# EAGLE schematic Outlet2 (EAGLE 7.5.0)
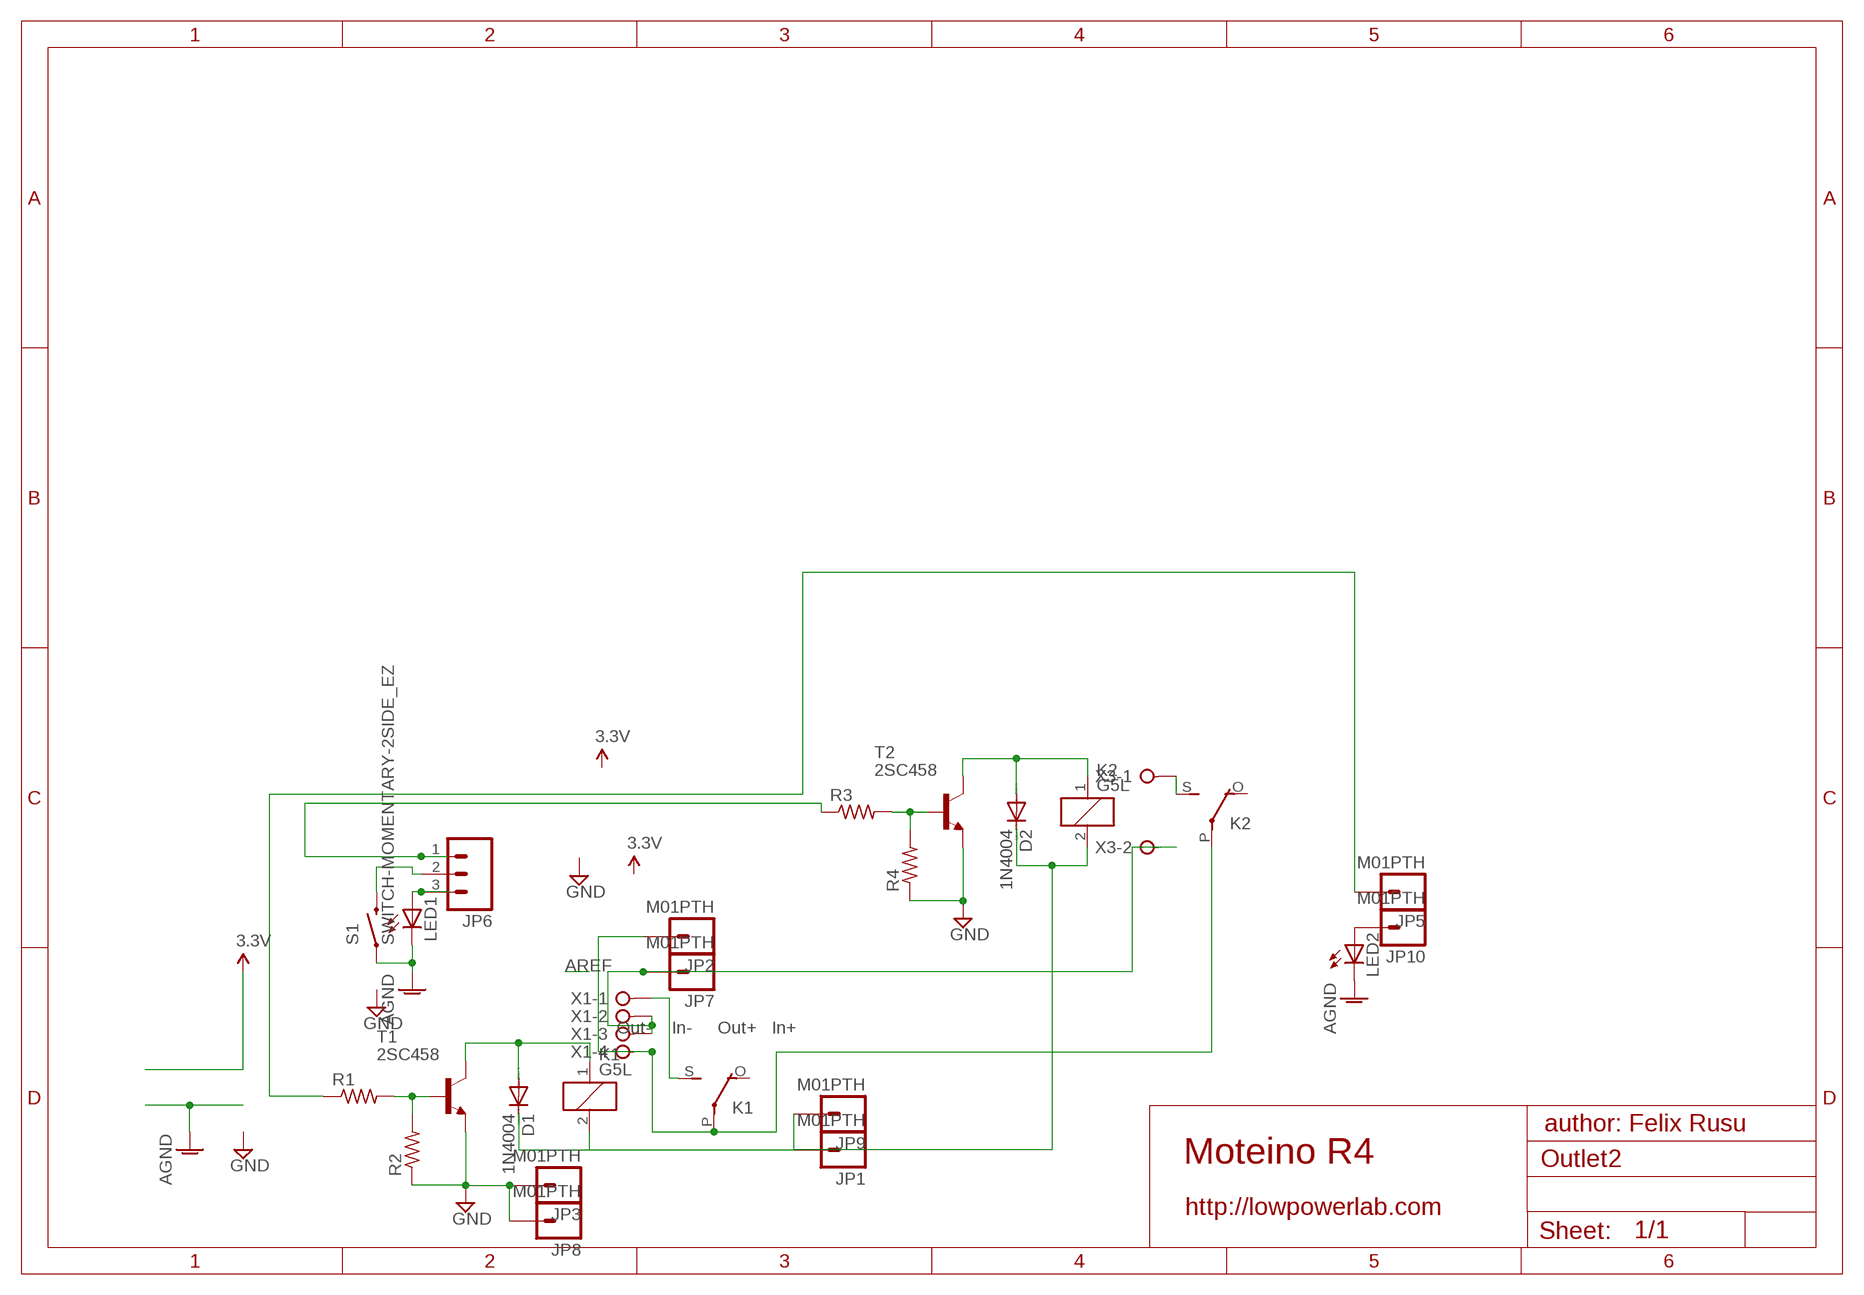
[diagram p0: schematic, sheet 1]

## Parts
D1  1N4004  [DO41-10]
D2  1N4004  [DO41-10]
JP1  M01PTH  [1X01]
JP2  M01PTH  [1X01]
JP3  M01PTH  [1X01]
JP5  M01PTH  [1X01]
JP6  M03PTH  [1X03]
JP7  M01PTH  [1X01]
JP8  M01PTH  [1X01]
JP9  M01PTH  [1X01]
JP10  M01PTH  [1X01]
K1  G5L  [G5LE]
K2  G5L  [G5LE]
LED1  LED3MM  [LED3MM]
LED2  LED3MM  [LED3MM]
R1  R-US_0204/7  [0204/7]
R2  R-US_0204/7  [0204/7]
R3  R-US_0204/7  [0204/7]
R4  R-US_0204/7  [0204/7]
S1  SWITCH-MOMENTARY-2SIDE_EZ  [TACTILE-PTH-SIDEEZ]
T1  2SC458  [TO92-ECB]
T2  2SC458  [TO92-ECB]
X1  Out- In- Out+ In+  W237-04P  [W237-4P]
X3  W237-02P  [W237-132]

## Nets
AGND [power]: LED1.K(C) LED2.K(C) S1.1
GND [power]: JP3.1 JP8.1 R2.1 R4.1 T1.E T2.E
N$1: JP6.2 S1.2
N$2: K2.S(2:S) X3.1
N$3: JP6.3 LED1.A
N$4: R1.2 R2.2 T1.B
N$5: JP10.1 LED2.A
N$6: D1.A K1.1 T1.C
N$7: JP5.1 R1.1
N$8: K1.S(2:S) X1.1
N$9: JP2.1 K1.P(2:P) K2.P(2:P) X1.4
N$10: JP6.1 R3.1
N$11: R3.2 R4.2 T2.B
N$12: D2.A K2.1 T2.C
N$13: D1.C D2.C JP1.1 JP9.1 K1.2 K2.2
N$15: JP7.1 X1.2 X1.3 X3.2
Unconnected: K1.O(2:O) K2.O(2:O)

## Notes on the sheet
- author: Felix Rusu
- Moteino R4
- http://lowpowerlab.com

## Library data of the parts
D1 D2 = diode:1N4004: DIODE general purpose rectifier, 1 A
JP1-JP3 JP5 JP7-JP10 = SparkFun-Connectors:M01: Header 1 Standard 1-pin 0.1" header. Use with straight break away headers (SKU : PRT-00116), right angle break away headers (PRT-00553), swiss pins (PRT-00743), machine pins (PRT-00117), and female headers (PRT-00115).
JP6 = SparkFun-Connectors:M03: Header 3 Standard 3-pin 0.1" header. Use with straight break away headers (SKU : PRT-00116), right angle break away headers (PRT-00553), swiss pins (PRT-00743), machine pins (PRT-00117), and female headers (PRT-00115). Molex polarized connector foot print use with SKU : PRT-08232 with associated crimp pins and housings.
K1 K2 = relay:G5L: RELAY 1 x switch, 10 A/120 V AC, 8 A/30 V ADC, Omron; OC_FARNELL: unknown; OC_NEWARK: unknown
LED1 LED2 = led:LED: LED OSRAM: - CHIPLED LG R971, LG N971, LY N971, LG Q971, LY Q971, LO R971, LY R971 LH N974, LH R974 LS Q976, LO Q976, LY Q976 LO Q996 - Hyper CHIPLED LW Q18S LB Q993, LB Q99A, LB R99A - SideLED LS A670, LO A670, LY A670, LG A670, LP A670 LB A673, LV A673, LT A673, LW A673 LH A674 LY A675 LS A676, LA A676, LO A676, LY A676, LW A676 LS A679, LY A679, LG A679 - Hyper Micro SIDELED® LS Y876, LA Y876, LO Y876, LY Y876 LT Y87S - SmartLED LW L88C, LW L88S LB L89C, LB L89S, LG L890 LS L89K, LO L89K, LY L89K LS L896, LA L896, LO L896, LY L896 - TOPLED LS T670, LO T670, LY T670, LG T670, LP T670 LSG T670, LSP T670, LSY T670, LOP T670, LYG T670 LG T671, LOG T671, LSG T671 LB T673, LV T673, LT T673, LW T673 LH T674 LS T676, LA T676, LO T676, LY T676, LB T676, LH T676, LSB T676, LW T676 LB T67C, LV T67C, LT T67C, LS T67K, LO T67K, LY T67K, LW E67C LS E67B, LA E67B, LO E67B, LY E67B, LB E67C, LV E67C, LT E67C LW T67C LS T679, LY T679, LG T679 LS T770, LO T770, LY T770, LG T770, LP T770 LB T773, LV T773, LT T773, LW T773 LH T774 LS E675, LA E675, LY E675, LS T675 LS T776, LA T776, LO T776, LY T776, LB T776 LHGB T686 LT T68C, LB T68C - Hyper Mini TOPLED® LB M676 - Mini TOPLED Santana® LG M470 LS M47K, LO M47K, LY M47K Source: http://www.osram.convergy.de LUXEON: - LUMILED® LXK2-PW12-R00, LXK2-PW12-S00, LXK2-PW14-U00, LXK2-PW14-V00 LXK2-PM12-R00, LXK2-PM12-S00, LXK2-PM14-U00 LXK2-PE12-Q00, LXK2-PE12-R00, LXK2-PE12-S00, LXK2-PE14-T00, LXK2-PE14-U00 LXK2-PB12-K00, LXK2-PB12-L00, LXK2-PB12-M00, LXK2-PB14-N00, LXK2-PB14-P00, LXK2-PB14-Q00 LXK2-PR12-L00, LXK2-PR12-M00, LXK2-PR14-Q00, LXK2-PR14-R00 LXK2-PD12-Q00, LXK2-PD12-R00, LXK2-PD12-S00 LXK2-PH12-R00, LXK2-PH12-S00 LXK2-PL12-P00, LXK2-PL12-Q00, LXK2-PL12-R00 Source: www.luxeon.com KINGBRIGHT: KA-3528ASYC Source: www.kingbright.com
R1-R4 = resistor:R-US_: RESISTOR, American symbol
S1 = SparkFun-Electromechanical:SWITCH-MOMENTARY-2: Various NO switches- pushbuttons, reed, etc
T1 T2 = transistor:2SC458: NPN Silicon Epitaxial Planar Transistor Source: SEMTECH ELECTRONICS LTD. ... 2SC458 1.pdf
X1 = con-wago-508:W237-04P: WAGO SREW CLAMP; MF: In-; MPN: Out-; OC_FARNELL: unknown; OC_NEWARK: unknown
X3 = con-wago-508:W237-02P: WAGO SREW CLAMP; OC_FARNELL: unknown; OC_NEWARK: unknown

## Net classes
1 power: width 0.381 mm, clearance 0.254 mm